# Altium schematic sheet SCH.SchDoc
size A4; SheetNumber: 1; SheetTotal: 1
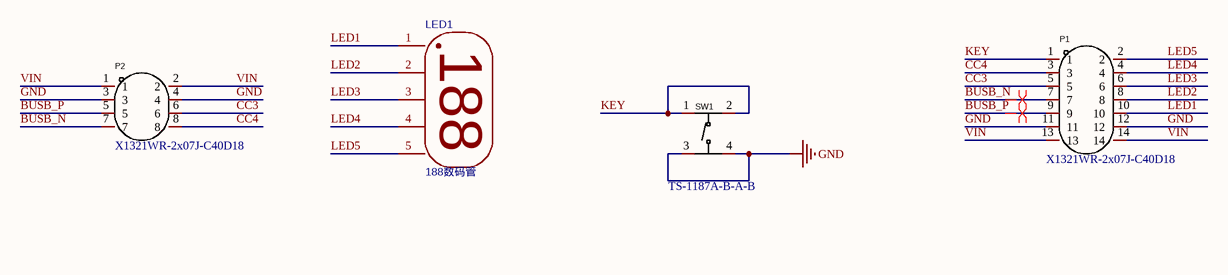
[diagram p0: SCH.SchDoc]

## Parts
LED1  188数码管  [LED_188]
P1  X1321WR-2x07J-C40D18  [HDR-TH_14P-P1.27-H-M-R2-C7-S1.27-W7.5-N]
P2  X1321WR-2x07J-C40D18  [HDR-TH_8P-P1.27]
SW1  TS-1187A-B-A-B  [SW-SMD_4P-L5.1-W5.1-P3.70-LS6.5-TL-2]

## Nets
GND: P1.11 P1.12 P2.3 P2.4 SW1.3(C) SW1.4(D)
BUSB_N: P1.7 P2.7
BUSB_P: P1.9 P2.5
CC3: P1.5 P2.6
CC4: P1.3 P2.8
KEY: P1.1 SW1.1(A) SW1.2(B)
LED1: LED1.1 P1.10
LED2: LED1.2 P1.8
LED3: LED1.3 P1.6
LED4: LED1.4 P1.4
LED5: LED1.5 P1.2
VIN: P1.13 P1.14 P2.1 P2.2

## Layout directives
differential pair: BUSB_N, BUSB_P

## Notes on the sheet
- (in symbol 188数码管) 188

## Library data of the parts
LED1 = 188数码管: Contributor: 微雪智能; link: https://item.taobao.com/item.htm?spm=a230r.1.14.30.334f1cb7MZebUt&id=633499956474&ns=1&abbucket=12#detail; spicePre: U; spiceSymbolName: 188数码管
P1 = X1321WR-2x07J-C40D18: Manufacturer: XKB Connectivity(中国星坤); Add into BOM: yes; Pitch: 1.27mm; Pin Structure: 2x7P; Circluar Pins/Square Pins: 方针; Current Rating (Max): 1A; Voltage Rating (Max): 250V; Welding Temperature (Max): 260℃; Name: X1321WR-2x07J-C40D18; Symbol: X1321WR-2X07J-C40D18; Device: X1321WR-2x07J-C40D18; LCSC Part Name: 1.27mm 2x7P 弯插 方针; Supplier Part: C2881827; Manufacturer Part: X1321WR-2x07J-C40D18; Supplier Footprint: 插件,P=1.27mm; JLCPCB Part Class: Extended Part; Supplier: LCSC; Convert to PCB: yes; Number of Pins: 14; Number of Rows: 2; Row Spacing: 1.27mm; Mounting Type: 弯插; Length of Mating Pin: 4mm; Insulation Height: 1mm; Length of End Connection Pin: -; Contact Material: 黄铜; Contact Plating: 金; Operating Temperature Range: -40℃~+105℃
P2 = 双排插针: 双排弯针2*4P; Manufacturer: XKB Connectivity(中国星坤); Add into BOM: yes; Pitch: 1.27mm; Pin Structure: 2x7P; Circluar Pins/Square Pins: 方针; Current Rating (Max): 1A; Voltage Rating (Max): 250V; Welding Temperature (Max): 260℃; Name: X1321WR-2x07J-C40D18; Symbol: X1321WR-2X07J-C40D18; Device: X1321WR-2x07J-C40D18; LCSC Part Name: 1.27mm 2x7P 弯插 方针; Supplier Part: C2881827; Manufacturer Part: X1321WR-2x07J-C40D18; Supplier Footprint: 插件,P=1.27mm; JLCPCB Part Class: Extended Part; Supplier: LCSC; Convert to PCB: yes; Number of Pins: 14; Number of Rows: 2; Row Spacing: 1.27mm; Mounting Type: 弯插; Length of Mating Pin: 4mm; Insulation Height: 1mm; Length of End Connection Pin: -; Contact Material: 黄铜; Contact Plating: 金; Operating Temperature Range: -40℃~+105℃
SW1 = TS-1187A-B-A-B: 按键; Manufacturer: XKB Connectivity(中国星坤); Add into BOM: yes; Contact Current: 50mA; Voltage Rating (DC): 12V; Circuit: 单刀单掷; Actuator Style: 圆形按钮; Actuator/Cap Color: 金色; With Lamp: 无; Operating Force: 160gf; Mechanical Life: 10万次; Switch Length: 5.1mm; Switch Height: 1.5mm; Strike Gundam: 否; Name: TS-1187A-B-A-B; Symbol: TS-1187A-B-A-B; Device: TS-1187A-B-A-B; LCSC Part Name: 5.1*5.1*1.5mm 立贴 轻触开关 防水金属头; Supplier Part: C318884; Manufacturer Part: TS-1187A-B-A-B; Supplier Footprint: SMD; JLCPCB Part Class: Basic Part; Datasheet: https://atta.szlcsc.com/upload/public/pdf/source/20200227/C318884_1F20165719E1C4CAA3E10C4C359C6E26.pdf; Supplier: LCSC; Convert to PCB: yes; Insulation Resistance: -; Mounting Style: 立贴; Operating Temperature: -30℃~+85℃; Switch Width: 5.1mm